# EAGLE design Boost_to_1V8 (EAGLE 7.2.0)
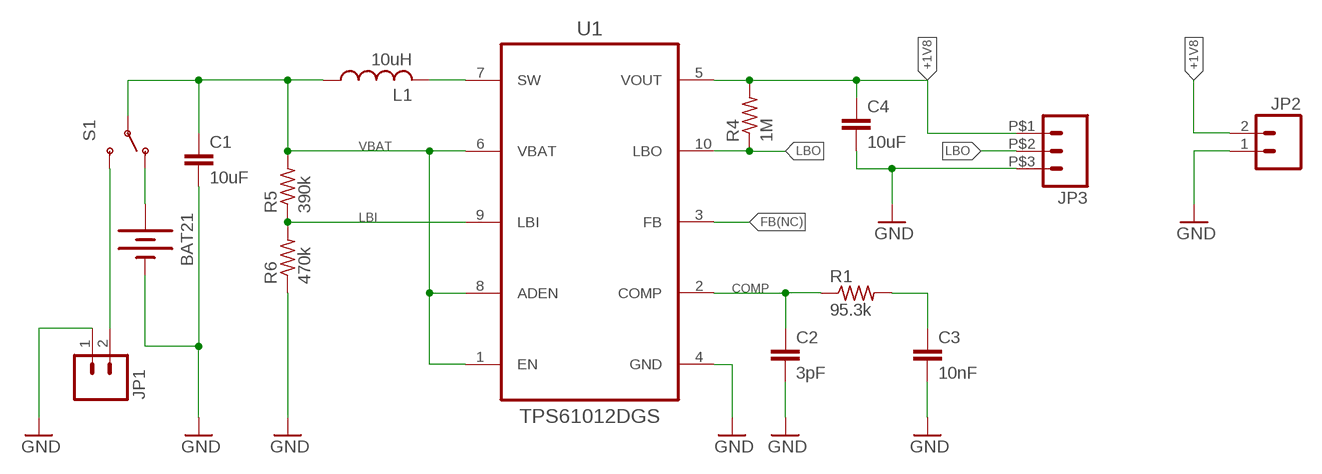
[diagram p0: schematic, sheet 1]

## Parts
BAT21  BATTERYAA  [BATTERY-AA]
C1  10uF  C-EUC1812  [C1812]
C2  3pF  C-EUC0805  [C0805]
C3  10nF  C-EUC0805  [C0805]
C4  10uF  C-EUC1812  [C1812]
JP1  M02JST-PTH-2  [JST-2-PTH]
JP2  M02JST-PTH-2  [JST-2-PTH]
JP3  M03  [1X03_282834-3]
L1  10uH  SUMIDA_POWER_INDUCTOR6  [CDRH6D38]
R1  95.3k  R-US_R0805  [R0805]
R4  1M  R-US_R0805  [R0805]
R5  390k  R-US_R0805  [R0805]
R6  470k  R-US_R0805  [R0805]
S1  SWITCH-SPDTPTH  [SWITCH-SPDT]
U1  TPS61012DGS  [SOP50P490X110-10N]

## Nets
+1V8: C4.1 JP2.2 JP3.P$1 R4.2 U1.5(VOUT)
BAT+ [big_power]: BAT21.PWR@1(+) BAT21.PWR@2(+) S1.1(O)
COMP: C2.1 R1.1 U1.2(COMP)
FB(NC): U1.3(FB)
GND: BAT21.GND@1(-) BAT21.GND@2(-) C1.2 C2.2 C3.2 C4.2 JP1.1 JP2.1 JP3.P$3 R6.1 U1.4(GND)
LBI: R5.1 R6.2 U1.9(LBI)
LBO: JP3.P$2 R4.1 U1.10(LBO)
N$1: C3.1 R1.2
N$2: JP1.2 S1.3(S)
SW: L1.P$2 U1.7(SW)
VBAT: C1.1 L1.P$1 R5.2 S1.2(P) U1.1(EN) U1.6(VBAT) U1.8(ADEN)

## Library data of the parts
BAT21 = DensityAltitude:BATTERY: Battery Holders Various common sizes : AA, AAA, 18650 (PRT-12895), 20mm coin cell and 12mm coin cell. 20MM_4LEGS, BATT-10373
C1-C4 = rcl:C-EU: CAPACITOR, European symbol
JP1 JP2 = DensityAltitude:M02: Standard 2-pin 0.1" header. Use with - straight break away headers ( PRT-00116) - right angle break away headers (PRT-00553) - swiss pins (PRT-00743) - machine pins (PRT-00117) - female headers (PRT-00115) Molex polarized connector foot print use with: PRT-08233 with associated crimp pins and housings. 2.54_SCREWTERM for use with PRT-10571. 3.5mm Screw Terminal footprints for PRT-08084 5mm Screw Terminal footprints for use with PRT-08432; PROD_ID: CONN-09863; SKU: PRT-09914
JP3 = DensityAltitude:M03: Header 3 Standard 3-pin 0.1" header. Use with straight break away headers (SKU : PRT-00116), right angle break away headers (PRT-00553), swiss pins (PRT-00743), machine pins (PRT-00117), and female headers (PRT-00115). Molex polarized connector foot print use with SKU : PRT-08232 with associated crimp pins and housings.
L1 = DensityAltitude:SUMIDA_POWER_INDUCTOR
R1 R4-R6 = rcl:R-US_: RESISTOR, American symbol
S1 = SparkFun-Electromechanical:SWITCH-SPDT: SPDT Switch Simple slide switch, Spark Fun Electronics SKU : COM-00102 DPDT SMT slide switch, AYZ0202, SWCH-08179; PROD_ID: SWCH-08261
U1 = DensityAltitude:TPS6101*: 1-CELL AND 2-CELL BOOST CONVERTERS; PACKAGE: MSOP-10; SUPPLIER: Texas Instruments; VOLTAGE: 1.8

## Net classes
1 big_power: width 1.93 mm

## Board
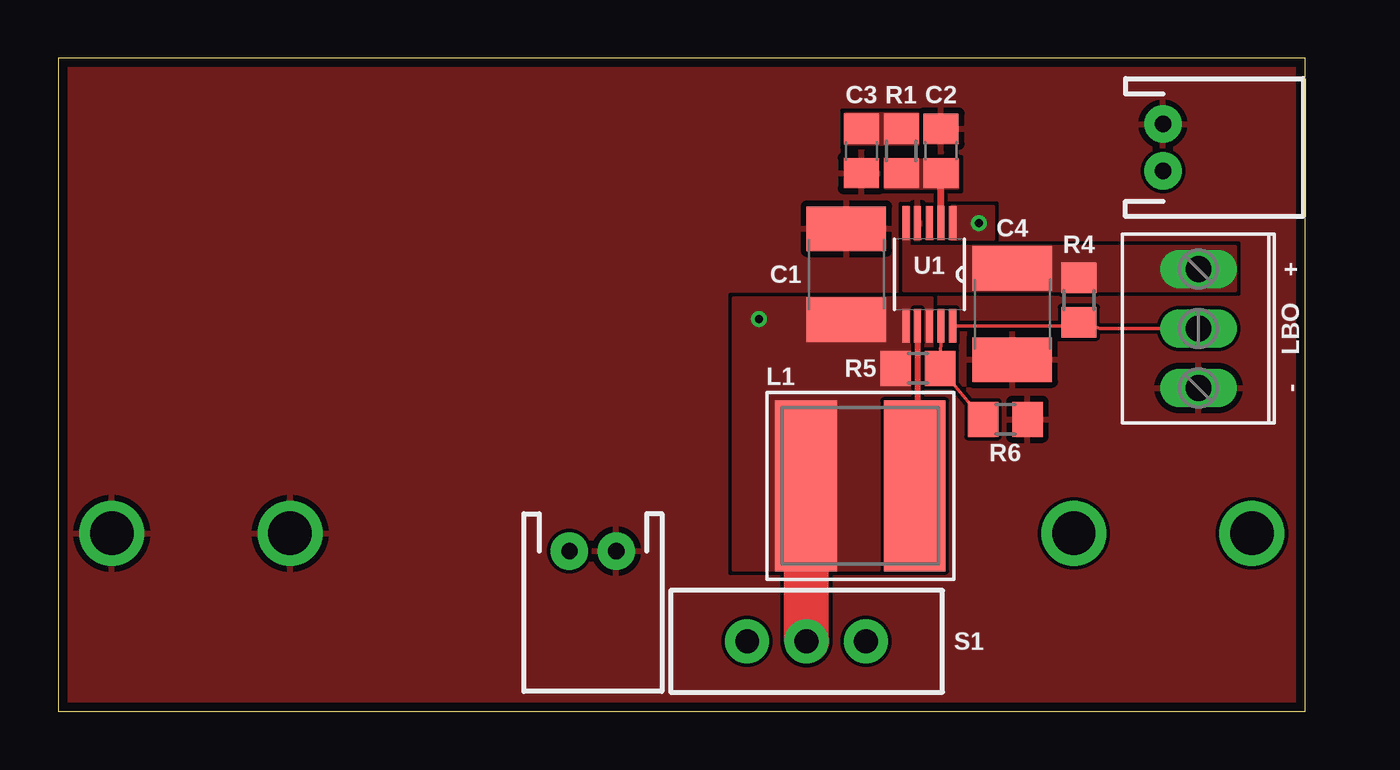
[diagram p1: board, top side]
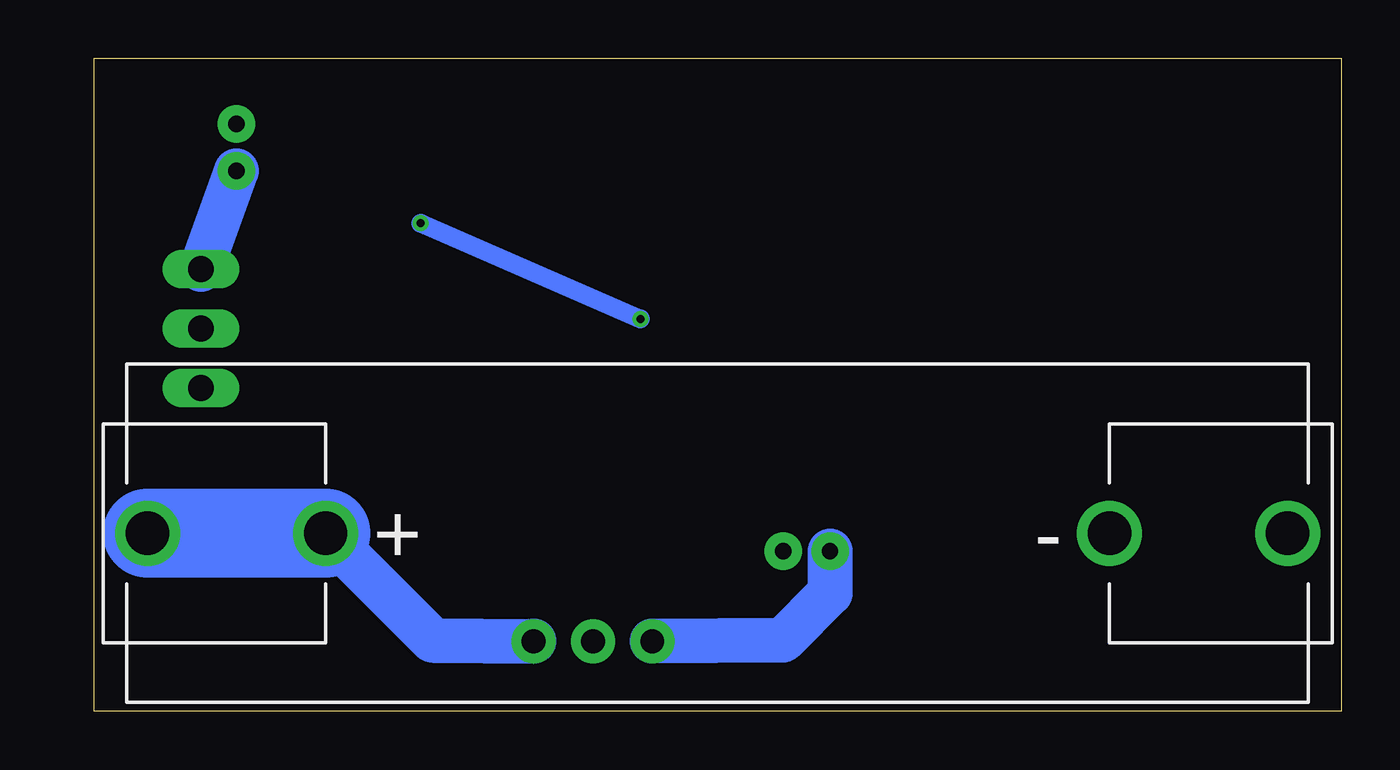
[diagram p2: board, bottom side, seen from below]

Size 53.34 x 27.94 mm. Coordinates in mm from the lower left corner, seen from the top.
Outline: 0,0 53.34,0 53.34,27.94 0,27.94 0,0
Copper layers (1*16): Top 0.0356mm / dielectric 1.5011mm / Bottom 0.0356mm
Design rules "oshpark-2layer": minimum track width 6mil, minimum drill 13mil, track to track 6mil, track to pad 6mil, pad to pad 6mil, via to via 6mil, smd to smd 6mil, copper to edge 15mil, drill to drill 6mil, minimum pad ring 7mil, minimum via ring 7mil, stop-mask expansion 4mil, vias tented up to drill 0mil, thermal gap 10mil

### Footprints (pad centres in the part's own frame; a part is rotated, then mirrored left to right if it is on the bottom)
BATTERY-AA = drill 1.854: GND@1 24.384,0; GND@2 16.764,0; PWR@1 -24.384,0; PWR@2 -16.764,0
C1812 = smd 1.9 x 3.4: 1 -1.95,0; 2 1.95,0
C0805 = smd 1.3 x 1.5: 1 -0.95,0; 2 0.95,0
JST-2-PTH = drill 0.7 pad 1.6: 1 -1,0; 2 1,0
1X03_282834-3 = drill 1.1 long: P$1 -2.54,0; P$2 0,0; P$3 2.54,0
CDRH6D38 = smd 2.65 x 7.3: P$1 -2.325,0; P$2 2.325,0
R0805 = smd 1.3 x 1.5: 1 -0.95,0; 2 0.95,0
SWITCH-SPDT = drill 1.016 pad 1.88: 1 0,2.54; 2 0,0; 3 0,-2.54
SOP50P490X110-10N = smd 1.45 x 0.3: 1 -2.2,1; 2 -2.2,0.5; 3 -2.2,0; 4 -2.2,-0.5; 5 -2.2,-1; 6 2.2,-1; 7 2.2,-0.5; 8 2.2,0; 9 2.2,0.5; 10 2.2,1

### Placement (x,y rotation side)
BAT21  26.67,7.62 0 bottom
C1  33.7,18.7 90 top
C2  37.75,23.98 90 top
C3  34.35,23.98 270 top
C4  40.8,17 270 top
JP1  22.86,6.86 180 top
JP2  47.24,24.13 270 top
JP3  48.77,16.38 270 top
L1  34.3,9.65 0 top
R1  36.05,23.98 90 top
R4  43.65,17.6 90 top
R5  36.77,14.68 180 top
R6  40.5,12.5 180 top
S1  32,3 270 top
U1  37.25,18.7 270 top

### Tracks (layer width: path | path; a pad name or v marks a point on that pad's centre or on a via)
+1V8
  Bottom 1.93: JP3.P$1 JP2.2
  pour Top (no thermals): 36.17,18 36.17,21.58 36.37,21.58 36.37,19.88 50.35,19.88 50.35,18
BAT+
  Bottom 1.93: BAT21.PWR@2 38.86,3.05 S1.1
  Bottom 3.81: BAT21.PWR@2 BAT21.PWR@1
COMP
  Top 0.3: U1.2 C2.1
  pour Top (no thermals): 35.37,23.58 35.37,22.38 38.47,22.38 38.47,23.58
GND
  pour Top (rank 2): 0,0 0,27.94 53.34,27.94 53.34,0
LBI
  Top 0.152: U1.9 R5.1 R6.2
LBO
  Top 0.152: U1.10 44.1,16.48 R4.1 44.54,16.38 JP3.P$2
N$1
  pour Top (no thermals): 33.67,25.58 33.67,24.28 36.77,24.28 36.77,25.58
N$2
  Bottom 1.93: JP1.2 21.86,5.06 23.88,3.05 S1.3
SW
  Top 0.254: U1.7 36.77,9.68
  Top 0.3: 36.77,9.68 L1.P$2
VBAT  (via drill 0.33)
  Top 1.93: S1.2 L1.P$1
  Bottom 0.813: v39.37,20.89 v29.97,16.79
  pour Top (no thermals): 37.37,6.07 37.37,17.68 28.87,17.68 28.87,6.07
  pour Top (no thermals): 38.2,20.2 40,20.2 40,21.6 38.2,21.6

### Text on the board
tPlace: + | LBO | -